# Altium project CPU.3.PrjPcb
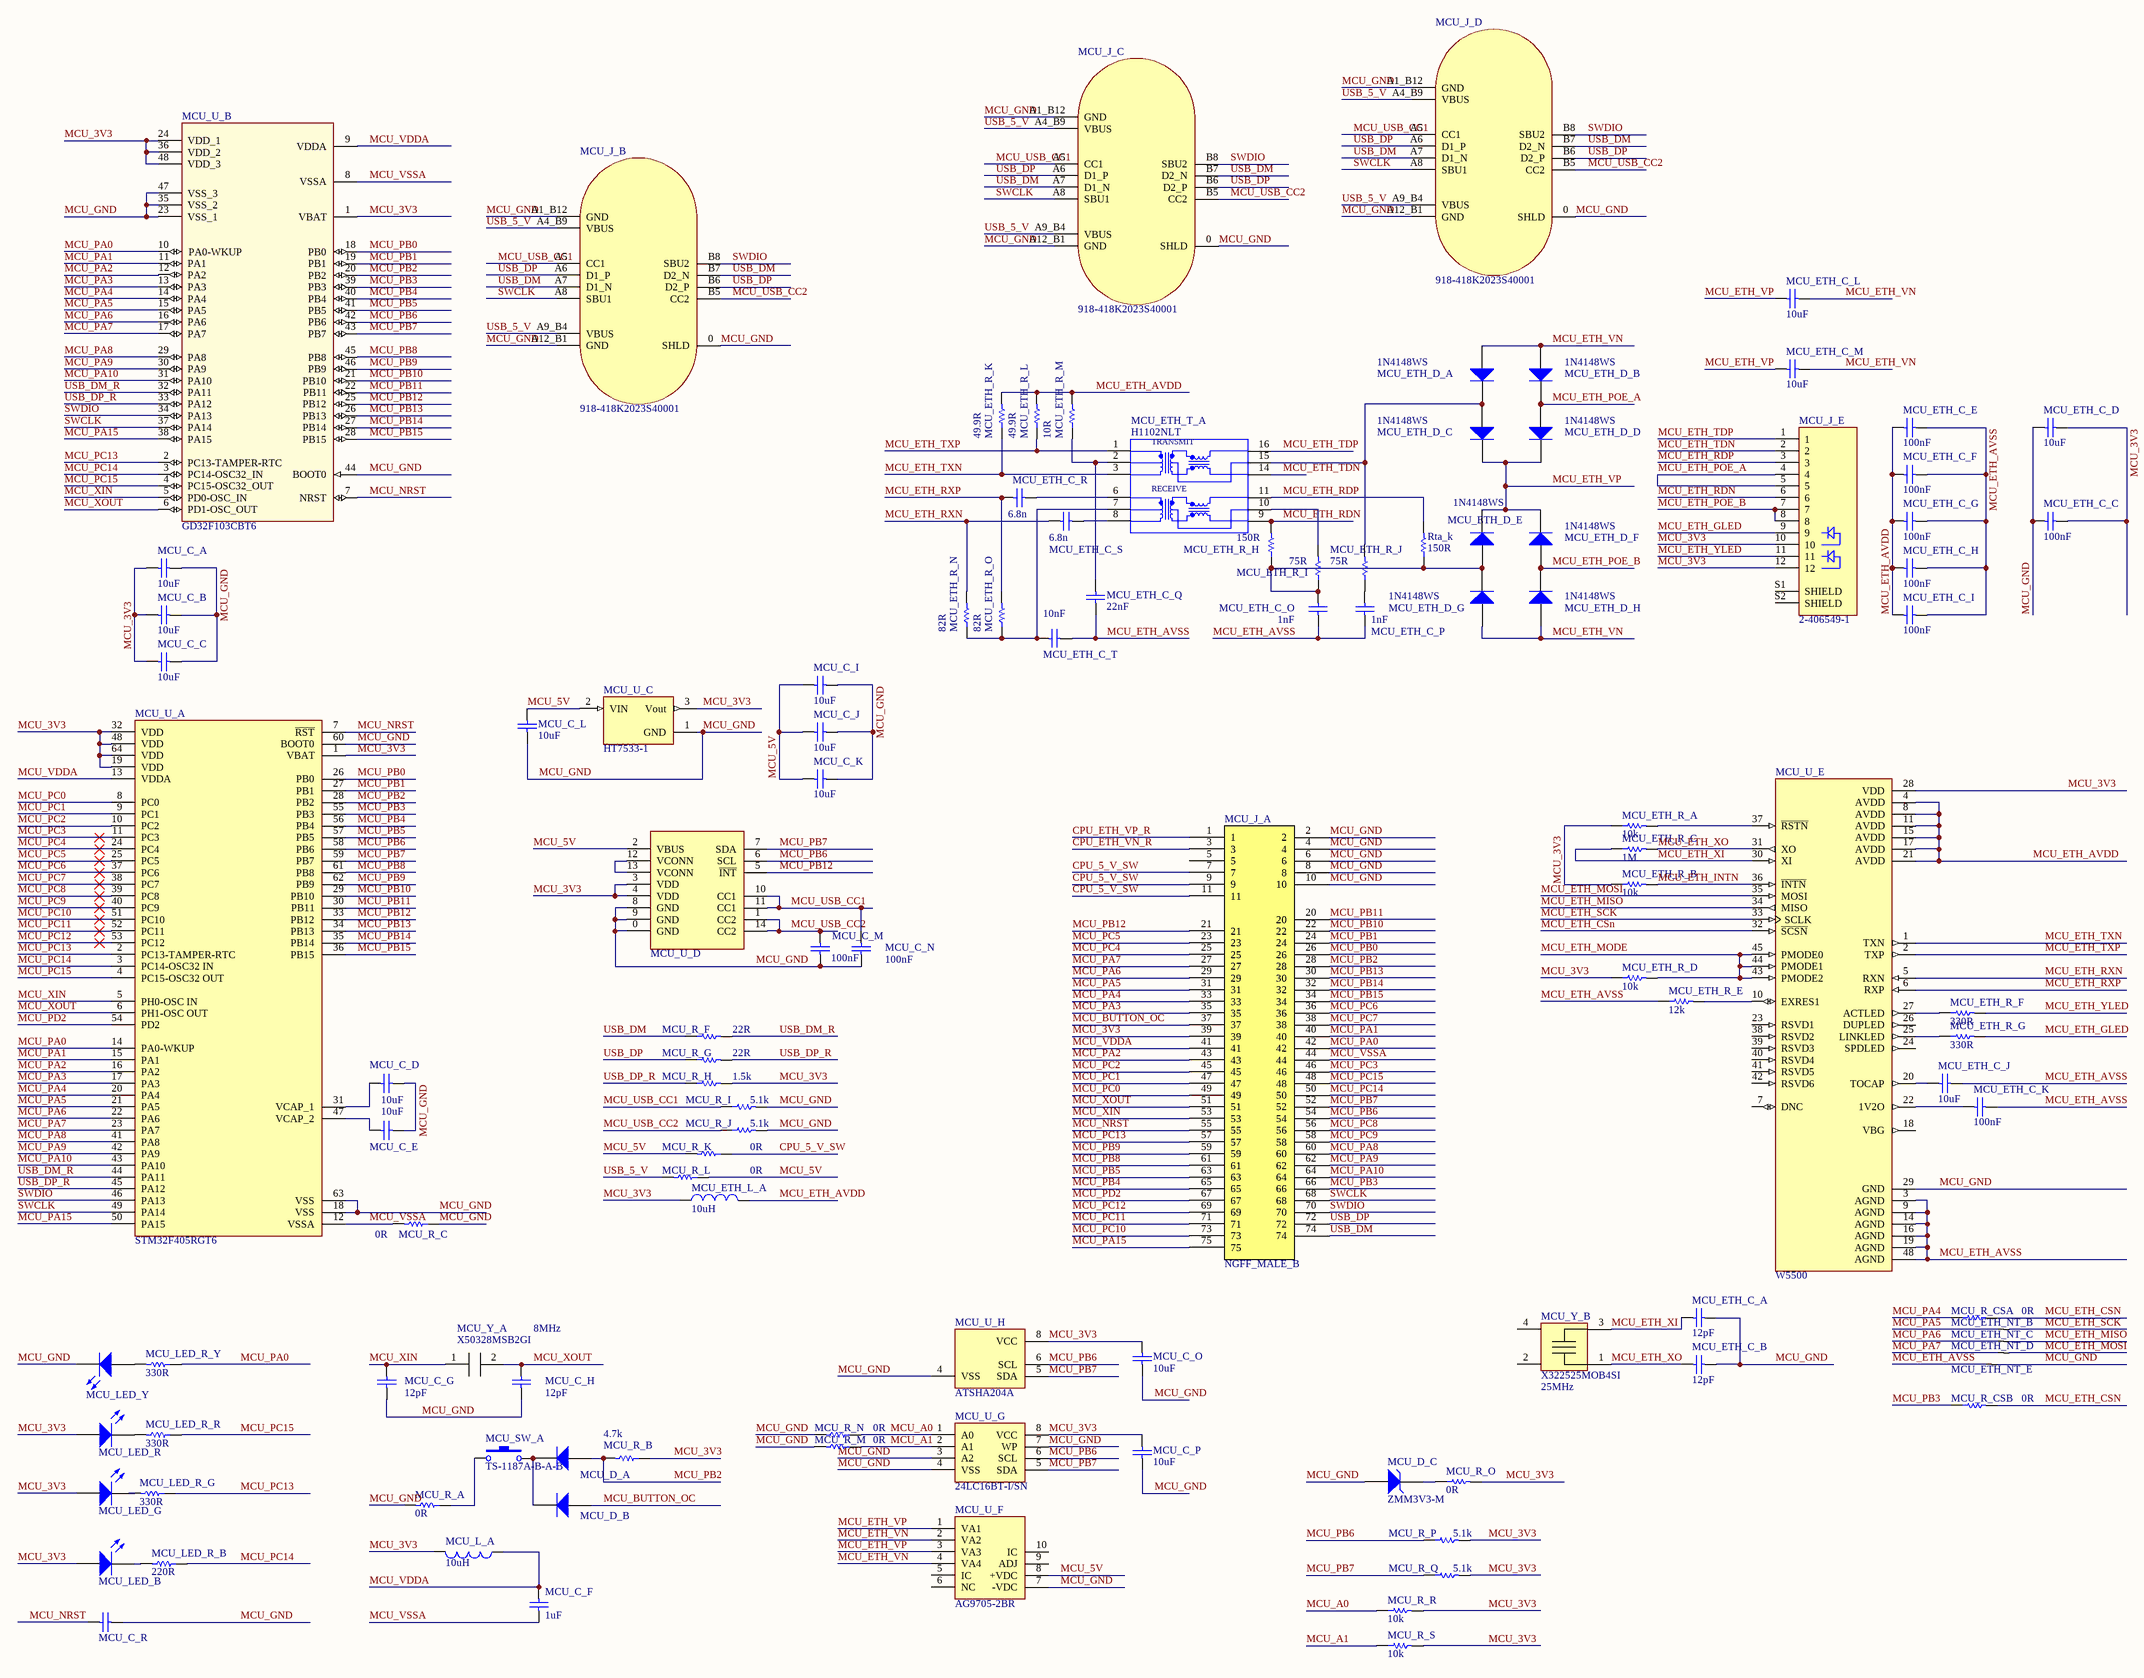
[diagram p0: CPU.3.SchDoc]
1 sheet, 113 parts. Net scope: global (net labels, ports and power ports of the same name join across sheets).
Board file: CPU.3.PcbDoc

## Sheet CPU.3.SchDoc
size C

### Parts
MCU_C_A  value 10uF  [C_0402]  (hidden comment: CL05A106MQ5NUNC)
MCU_C_B  value 10uF  [C_0402]  (hidden comment: CL05A106MQ5NUNC)
MCU_C_C  value 10uF  [C_0402]  (hidden comment: CL05A106MQ5NUNC)
MCU_C_D  value 10uF  [C_0402]  (hidden comment: CL05A106MQ5NUNC)
MCU_C_E  value 10uF  [C_0402]  (hidden comment: CL05A106MQ5NUNC)
MCU_C_F  value 1uF  [C_0402]  (hidden comment: CL05A105KA5NQNC)
MCU_C_G  value 12pF  [C_0402]  (hidden comment: 0402CG120J500NT)
MCU_C_H  value 12pF  [C_0402]  (hidden comment: 0402CG120J500NT)
MCU_C_I  value 10uF  [C_0402]  (hidden comment: CL05A106MQ5NUNC)
MCU_C_J  value 10uF  [C_0402]  (hidden comment: CL05A106MQ5NUNC)
MCU_C_K  value 10uF  [C_0402]  (hidden comment: CL05A106MQ5NUNC)
MCU_C_L  value 10uF  [C_0805]  (hidden comment: CL21A106KAYNNNE)
MCU_C_M  value 100nF  [C_0402]  (hidden comment: CL05B104KO5NNNC)
MCU_C_N  value 100nF  [C_0402]  (hidden comment: CL05B104KO5NNNC)
MCU_C_O  value 10uF  [C_0402]  (hidden comment: CL05A106MQ5NUNC)
MCU_C_P  value 10uF  [C_0402]  (hidden comment: CL05A106MQ5NUNC)
MCU_C_R  0402CG101J500NT  [C_0402]  (value not drawn)
MCU_D_A  1N4148WS  [SOD-323]  (value not drawn)
MCU_D_B  1N4148WS  [SOD-323]  (value not drawn)
MCU_D_C  ZMM3V3-M  [DO-213AA]
MCU_ETH_C_A  value 12pF  [C_0402]  (hidden comment: 0402CG120J500NT)
MCU_ETH_C_B  value 12pF  [C_0402]  (hidden comment: 0402CG120J500NT)
MCU_ETH_C_C  value 100nF  [C_0402]  (hidden comment: CL05B104KO5NNNC)
MCU_ETH_C_D  value 10uF  [C_0402]  (hidden comment: CL05A106MQ5NUNC)
MCU_ETH_C_E  value 100nF  [C_0402]  (hidden comment: CL05B104KO5NNNC)
MCU_ETH_C_F  value 100nF  [C_0402]  (hidden comment: CL05B104KO5NNNC)
MCU_ETH_C_G  value 100nF  [C_0402]  (hidden comment: CL05B104KO5NNNC)
MCU_ETH_C_H  value 100nF  [C_0402]  (hidden comment: CL05B104KO5NNNC)
MCU_ETH_C_I  value 100nF  [C_0402]  (hidden comment: CL05B104KO5NNNC)
MCU_ETH_C_J  value 10uF  [C_0402]  (hidden comment: CL05A106MQ5NUNC)
MCU_ETH_C_K  value 100nF  [C_0402]  (hidden comment: CL05B104KO5NNNC)
MCU_ETH_C_L  value 10uF  [C_0805]  (hidden comment: CL21A106KAYNNNE)
MCU_ETH_C_M  value 10uF  [C_0805]  (hidden comment: CL21A106KAYNNNE)
MCU_ETH_C_O  value 1nF  [C_1206]  (hidden comment: 1206B102K202NT)
MCU_ETH_C_P  value 1nF  [C_1206]  (hidden comment: 1206B102K202NT)
MCU_ETH_C_Q  value 22nF  [C_0402]  (hidden comment: 0402B223K500NT)
MCU_ETH_C_R  value 6.8n  [C_0402]  (hidden comment: 0402B682K500NT)
MCU_ETH_C_S  value 6.8n  [C_0402]  (hidden comment: 0402B682K500NT)
MCU_ETH_C_T  value 10nF  [C_0402]  (hidden comment: CL05B103KB5NNNC)
MCU_ETH_D_A  1N4148WS  [SOD-323]
MCU_ETH_D_B  1N4148WS  [SOD-323]
MCU_ETH_D_C  1N4148WS  [SOD-323]
MCU_ETH_D_D  1N4148WS  [SOD-323]
MCU_ETH_D_E  1N4148WS  [SOD-323]
MCU_ETH_D_F  1N4148WS  [SOD-323]
MCU_ETH_D_G  1N4148WS  [SOD-323]
MCU_ETH_D_H  1N4148WS  [SOD-323]
MCU_ETH_L_A  value 10uH  [L_0603]  (hidden comment: SDFL1608S100KTF)
MCU_ETH_NT_B  0  [NET_TIE]  (value not drawn)
MCU_ETH_NT_C  0  [NET_TIE]  (value not drawn)
MCU_ETH_NT_D  0  [NET_TIE]  (value not drawn)
MCU_ETH_NT_E  0  [NET_TIE]  (value not drawn)
MCU_ETH_R_A  value 10k  [R_0402]  (hidden comment: 0402WGF1002TCE)
MCU_ETH_R_B  value 10k  [R_0402]  (hidden comment: 0402WGF1002TCE)
MCU_ETH_R_C  value 1M  [R_0402]  (hidden comment: 0402WGF1004TCE)
MCU_ETH_R_D  value 10k  [R_0402]  (hidden comment: 0402WGF1002TCE)
MCU_ETH_R_E  value 12k  [R_0402]  (hidden comment: 0402WGF1202TCE)
MCU_ETH_R_F  value 330R  [R_0402]  (hidden comment: 0402WGF3300TCE)
MCU_ETH_R_G  value 330R  [R_0402]  (hidden comment: 0402WGF3300TCE)
MCU_ETH_R_H  value 150R  [R_0402]  (hidden comment: 0402WGF1500TCE)
MCU_ETH_R_I  value 75R  [R_0402]  (hidden comment: 0402WGF750JTCE)
MCU_ETH_R_J  value 75R  [R_0402]  (hidden comment: 0402WGF750JTCE)
MCU_ETH_R_K  value 49.9R  [R_0402]  (hidden comment: 0402WGF499JTCE)
MCU_ETH_R_L  value 49.9R  [R_0402]  (hidden comment: 0402WGF499JTCE)
MCU_ETH_R_M  value 10R  [R_0402]  (hidden comment: 0402WGF100JTCE)
MCU_ETH_R_N  value 82R  [R_0603]  (hidden comment: 0603WAF820JT5E)
MCU_ETH_R_O  value 82R  [R_0603]  (hidden comment: 0603WAF820JT5E)
MCU_ETH_T_A  H1102NLT  [XFMR_H1102NLT]
MCU_J_A  NGFF_MALE_B  [NGFF_MALE_B]
MCU_J_B  918-418K2023S40001  [DX07S016JA1R1500]
MCU_J_C  918-418K2023S40001  [DX07S016JA1R1500]
MCU_J_D  918-418K2023S40001  [DX07S016JA1R1500]
MCU_J_E  2-406549-1  [TE_2-406549-1]
MCU_L_A  value 10uH  [L_0603]  (hidden comment: SDFL1608S100KTF)
MCU_LED_B  19-217/BHC-ZL1M2RY/3T  [D_0603]  (value not drawn)
MCU_LED_G  19-217/GHC-YR1S2/3T  [D_0603]  (value not drawn)
MCU_LED_R  KT-0603R  [D_0603]  (value not drawn)
MCU_LED_R_B  value 220R  [R_0402]  (hidden comment: 0402WGF2200TCE)
MCU_LED_R_G  value 330R  [R_0402]  (hidden comment: 0402WGF3300TCE)
MCU_LED_R_R  value 330R  [R_0402]  (hidden comment: 0402WGF3300TCE)
MCU_LED_R_Y  value 330R  [R_0402]  (hidden comment: 0402WGF3300TCE)
MCU_LED_Y  19-21UYC/S530-A4/TR8  [D_0603]  (value not drawn)
MCU_R_A  value 0R  [R_0402]  (hidden comment: 0402WGF0000TCE)
MCU_R_B  value 4.7k  [R_0402]  (hidden comment: 0402WGF4701TCE)
MCU_R_C  value 0R  [R_0402]  (hidden comment: 0402WGF0000TCE)
MCU_R_CSA  value 0R  [R_0402]  (hidden comment: 0402WGF0000TCE)
MCU_R_CSB  value 0R  [R_0402]  (hidden comment: 0402WGF0000TCE)
MCU_R_F  value 22R  [R_0402]  (hidden comment: 0402WGF220JTCE)
MCU_R_G  value 22R  [R_0402]  (hidden comment: 0402WGF220JTCE)
MCU_R_H  value 1.5k  [R_0402]  (hidden comment: 0402WGF1501TCE)
MCU_R_I  value 5.1k  [R_0402]  (hidden comment: 0402WGF5101TCE)
MCU_R_J  value 5.1k  [R_0402]  (hidden comment: 0402WGF5101TCE)
MCU_R_K  value 0R  [R_0402]  (hidden comment: 0402WGF0000TCE)
MCU_R_L  value 0R  [R_0402]  (hidden comment: 0402WGF0000TCE)
MCU_R_M  value 0R  [R_0402]  (hidden comment: 0402WGF0000TCE)
MCU_R_N  value 0R  [R_0402]  (hidden comment: 0402WGF0000TCE)
MCU_R_O  value 0R  [R_0402]  (hidden comment: 0402WGF0000TCE)
MCU_R_P  value 5.1k  [R_0402]  (hidden comment: 0402WGF5101TCE)
MCU_R_Q  value 5.1k  [R_0402]  (hidden comment: 0402WGF5101TCE)
MCU_R_R  value 10k  [R_0402]  (hidden comment: 0402WGF1002TCE)
MCU_R_S  value 10k  [R_0402]  (hidden comment: 0402WGF1002TCE)
MCU_SW_A  TS-1187A-B-A-B  [TS-1187A-C-C-B]
MCU_U_A  STM32F405RGT6  [QFP-64-P0.5MM]
MCU_U_B  GD32F103CBT6  [QFP-48-P0.5MM]
MCU_U_C  HT7533-1  [SOT-223-3]
MCU_U_D  FUSB302BMPX  [QFN-14-P0.5MM]  (value not drawn)
MCU_U_E  W5500  [QFP-48-P0.5MM]
MCU_U_F  AG9705-2BR  [AG9000]
MCU_U_G  24LC16BT-I/SN  [SOIC-8-P1.27-W3.5]
MCU_U_H  ATSHA204A  [SOIC-8-P1.27-W3.5]
MCU_Y_A  X50328MSB2GI  value 8MHz  [YSX530GA]
MCU_Y_B  X322525MOB4SI  value 25MHz  [X322512MSB4SI]
Rta_k  value 150R  [R_0402]  (hidden comment: 0402WGF1500TCE)

### Nets
CPU_5_V_SW: MCU_J_A.7 MCU_J_A.9 MCU_J_A.11 MCU_R_K.1
CPU_ETH_VN_R: MCU_J_A.3
CPU_ETH_VP_R: MCU_J_A.1
MCU_3V3: MCU_C_A.1 MCU_C_B.1 MCU_C_C.1 MCU_C_O.2 MCU_C_P.2 MCU_ETH_C_C.2 MCU_ETH_C_D.1 MCU_ETH_L_A.1 MCU_ETH_R_A.1 MCU_ETH_R_B.1 MCU_ETH_R_D.1 MCU_J_A.39 MCU_J_E.10 MCU_J_E.12 MCU_L_A.2 MCU_LED_B.2(A) MCU_LED_G.2(A) MCU_LED_R.2(A) MCU_R_B.1 MCU_R_H.2 MCU_R_O.2 MCU_R_P.2 MCU_R_Q.2 MCU_R_R.2 MCU_R_S.2 MCU_U_A.1(VBAT) MCU_U_A.19(VDD) MCU_U_A.32(VDD) MCU_U_A.48(VDD) MCU_U_A.64(VDD) MCU_U_B.1(VBAT) MCU_U_B.24(VDD_1) MCU_U_B.36(VDD_2) MCU_U_B.48(VDD_3) MCU_U_C.3(Vout) MCU_U_D.3(VDD) MCU_U_D.4(VDD) MCU_U_E.28(VDD) MCU_U_G.8(VCC) MCU_U_H.8(VCC)
MCU_5V: MCU_C_I.1 MCU_C_J.1 MCU_C_K.1 MCU_C_L.2 MCU_R_K.2 MCU_R_L.1 MCU_U_C.2(VIN) MCU_U_D.2(VBUS) MCU_U_F.8(+VDC)
MCU_A0: MCU_R_N.1 MCU_R_R.1 MCU_U_G.1(A0)
MCU_A1: MCU_R_M.1 MCU_R_S.1 MCU_U_G.2(A1)
MCU_BUTTON_OC: MCU_D_B.2(A) MCU_J_A.37
MCU_ETH_AVDD: MCU_ETH_C_E.2 MCU_ETH_C_F.2 MCU_ETH_C_G.2 MCU_ETH_C_H.2 MCU_ETH_C_I.2 MCU_ETH_L_A.2 MCU_ETH_R_K.2 MCU_ETH_R_L.2 MCU_ETH_R_M.2 MCU_U_E.4(AVDD) MCU_U_E.8(AVDD) MCU_U_E.11(AVDD) MCU_U_E.15(AVDD) MCU_U_E.17(AVDD) MCU_U_E.21(AVDD)
MCU_ETH_AVSS: MCU_ETH_C_E.1 MCU_ETH_C_F.1 MCU_ETH_C_G.1 MCU_ETH_C_H.1 MCU_ETH_C_I.1 MCU_ETH_C_J.2 MCU_ETH_C_K.1 MCU_ETH_C_O.1 MCU_ETH_C_P.1 MCU_ETH_C_Q.1 MCU_ETH_C_T.2 MCU_ETH_NT_E.1 MCU_ETH_R_E.1 MCU_U_E.3(AGND) MCU_U_E.9(AGND) MCU_U_E.14(AGND) MCU_U_E.16(AGND) MCU_U_E.19(AGND) MCU_U_E.48(AGND)
MCU_ETH_CSn: MCU_R_CSA.2 MCU_R_CSB.2 MCU_U_E.32(~{SCSN})
MCU_ETH_GLED: MCU_ETH_R_G.2 MCU_J_E.9
MCU_ETH_INTN: MCU_ETH_R_B.2 MCU_U_E.36(~{INTN})
MCU_ETH_MISO: MCU_ETH_NT_C.2 MCU_U_E.34(MISO)
MCU_ETH_MODE: MCU_ETH_R_D.2 MCU_U_E.43(PMODE2) MCU_U_E.44(PMODE1) MCU_U_E.45(PMODE0)
MCU_ETH_MOSI: MCU_ETH_NT_D.2 MCU_U_E.35(MOSI)
MCU_ETH_POE_A: MCU_ETH_D_B.1(K) MCU_ETH_D_D.2(A) MCU_J_E.4 MCU_J_E.5
MCU_ETH_POE_B: MCU_ETH_D_F.2(A) MCU_ETH_D_H.1(K) MCU_J_E.7 MCU_J_E.8
MCU_ETH_RDN: MCU_ETH_R_H.2 MCU_ETH_T_A.9 MCU_J_E.6
MCU_ETH_RDP: MCU_ETH_T_A.11 MCU_J_E.3 Rta_k.2
MCU_ETH_RXN: MCU_ETH_C_S.1 MCU_ETH_R_N.2 MCU_U_E.5(RXN)
MCU_ETH_RXP: MCU_ETH_C_R.1 MCU_ETH_R_O.2 MCU_U_E.6(RXP)
MCU_ETH_SCK: MCU_ETH_NT_B.2 MCU_U_E.33(SCLK)
MCU_ETH_TDN: MCU_ETH_T_A.14 MCU_J_E.2
MCU_ETH_TDP: MCU_ETH_T_A.16 MCU_J_E.1
MCU_ETH_TXN: MCU_ETH_R_K.1 MCU_ETH_T_A.3 MCU_U_E.1(TXN)
MCU_ETH_TXP: MCU_ETH_R_L.1 MCU_ETH_T_A.1 MCU_U_E.2(TXP)
MCU_ETH_VN: MCU_ETH_C_L.1 MCU_ETH_C_M.1 MCU_ETH_D_A.2(A) MCU_ETH_D_B.2(A) MCU_ETH_D_G.2(A) MCU_ETH_D_H.2(A) MCU_U_F.2(VA2) MCU_U_F.4(VA4)
MCU_ETH_VP: MCU_ETH_C_L.2 MCU_ETH_C_M.2 MCU_ETH_D_C.1(K) MCU_ETH_D_D.1(K) MCU_ETH_D_E.1(K) MCU_ETH_D_F.1(K) MCU_U_F.1(VA1) MCU_U_F.3(VA3)
MCU_ETH_XI: MCU_ETH_C_A.2 MCU_ETH_R_C.1 MCU_U_E.30(XI) MCU_Y_B.3
MCU_ETH_XO: MCU_ETH_C_B.2 MCU_ETH_R_C.2 MCU_U_E.31(XO) MCU_Y_B.1
MCU_ETH_YLED: MCU_ETH_R_F.2 MCU_J_E.11
MCU_GND: MCU_C_A.2 MCU_C_B.2 MCU_C_C.2 MCU_C_D.2 MCU_C_E.2 MCU_C_G.1 MCU_C_H.1 MCU_C_I.2 MCU_C_J.2 MCU_C_K.2 MCU_C_L.1 MCU_C_M.2 MCU_C_N.2 MCU_C_O.1 MCU_C_P.1 MCU_C_R.1 MCU_D_C.2(A) MCU_ETH_C_A.1 MCU_ETH_C_B.1 MCU_ETH_C_C.1 MCU_ETH_C_D.2 MCU_ETH_NT_E.2 MCU_J_A.2 MCU_J_A.4 MCU_J_A.6 MCU_J_A.8 MCU_J_A.10 MCU_J_B.0(SHLD) MCU_J_B.A1_B12(GND) MCU_J_B.A12_B1(GND) MCU_J_C.0(SHLD) MCU_J_C.A1_B12(GND) MCU_J_C.A12_B1(GND) MCU_J_D.0(SHLD) MCU_J_D.A1_B12(GND) MCU_J_D.A12_B1(GND) MCU_LED_Y.1(K) MCU_R_A.2 MCU_R_C.1 MCU_R_I.2 MCU_R_J.2 MCU_R_M.2 MCU_R_N.2 MCU_U_A.18(VSS) MCU_U_A.60(BOOT0) MCU_U_A.63(VSS) MCU_U_B.23(VSS_1) MCU_U_B.35(VSS_2) MCU_U_B.44(BOOT0) MCU_U_B.47(VSS_3) MCU_U_C.1(GND) MCU_U_D.0(GND) MCU_U_D.8(GND) MCU_U_D.9(GND) MCU_U_E.29(GND) MCU_U_F.7(-VDC) MCU_U_G.3(A2) MCU_U_G.4(VSS) MCU_U_G.7(WP) MCU_U_H.4(VSS)
MCU_NRST: MCU_C_R.2 MCU_J_A.55 MCU_U_A.7(~{RST}) MCU_U_B.7(NRST)
MCU_PA0: MCU_J_A.42 MCU_LED_R_Y.1 MCU_U_A.14(PA0-WKUP) MCU_U_B.10(PA0-WKUP)
MCU_PA1: MCU_J_A.40 MCU_U_A.15(PA1) MCU_U_B.11(PA1)
MCU_PA2: MCU_J_A.43 MCU_U_A.16(PA2) MCU_U_B.12(PA2)
MCU_PA3: MCU_J_A.35 MCU_U_A.17(PA3) MCU_U_B.13(PA3)
MCU_PA4: MCU_J_A.33 MCU_R_CSA.1 MCU_U_A.20(PA4) MCU_U_B.14(PA4)
MCU_PA5: MCU_ETH_NT_B.1 MCU_J_A.31 MCU_U_A.21(PA5) MCU_U_B.15(PA5)
MCU_PA6: MCU_ETH_NT_C.1 MCU_J_A.29 MCU_U_A.22(PA6) MCU_U_B.16(PA6)
MCU_PA7: MCU_ETH_NT_D.1 MCU_J_A.27 MCU_U_A.23(PA7) MCU_U_B.17(PA7)
MCU_PA8: MCU_J_A.60 MCU_U_A.41(PA8) MCU_U_B.29(PA8)
MCU_PA9: MCU_J_A.62 MCU_U_A.42(PA9) MCU_U_B.30(PA9)
MCU_PA10: MCU_J_A.64 MCU_U_A.43(PA10) MCU_U_B.31(PA10)
MCU_PA15: MCU_J_A.75 MCU_U_A.50(PA15) MCU_U_B.38(PA15)
MCU_PB0: MCU_J_A.26 MCU_U_A.26(PB0) MCU_U_B.18(PB0)
MCU_PB1: MCU_J_A.24 MCU_U_A.27(PB1) MCU_U_B.19(PB1)
MCU_PB2: MCU_D_A.2(A) MCU_J_A.28 MCU_R_B.2 MCU_U_A.28(PB2) MCU_U_B.20(PB2)
MCU_PB3: MCU_J_A.66 MCU_R_CSB.1 MCU_U_A.55(PB3) MCU_U_B.39(PB3)
MCU_PB4: MCU_J_A.65 MCU_U_A.56(PB4) MCU_U_B.40(PB4)
MCU_PB5: MCU_J_A.63 MCU_U_A.57(PB5) MCU_U_B.41(PB5)
MCU_PB6: MCU_J_A.54 MCU_R_P.1 MCU_U_A.58(PB6) MCU_U_B.42(PB6) MCU_U_D.6(SCL) MCU_U_G.6(SCL) MCU_U_H.6(SCL)
MCU_PB7: MCU_J_A.52 MCU_R_Q.1 MCU_U_A.59(PB7) MCU_U_B.43(PB7) MCU_U_D.7(SDA) MCU_U_G.5(SDA) MCU_U_H.5(SDA)
MCU_PB8: MCU_J_A.61 MCU_U_A.61(PB8) MCU_U_B.45(PB8)
MCU_PB9: MCU_J_A.59 MCU_U_A.62(PB9) MCU_U_B.46(PB9)
MCU_PB10: MCU_J_A.22 MCU_U_A.29(PB10) MCU_U_B.21(PB10)
MCU_PB11: MCU_J_A.20 MCU_U_A.30(PB11) MCU_U_B.22(PB11)
MCU_PB12: MCU_J_A.21 MCU_U_A.33(PB12) MCU_U_B.25(PB12) MCU_U_D.5(~{INT})
MCU_PB13: MCU_J_A.30 MCU_U_A.34(PB13) MCU_U_B.26(PB13)
MCU_PB14: MCU_J_A.32 MCU_U_A.35(PB14) MCU_U_B.27(PB14)
MCU_PB15: MCU_J_A.34 MCU_U_A.36(PB15) MCU_U_B.28(PB15)
MCU_PC0: MCU_J_A.49 MCU_U_A.8(PC0)
MCU_PC1: MCU_J_A.47 MCU_U_A.9(PC1)
MCU_PC2: MCU_J_A.45 MCU_U_A.10(PC2)
MCU_PC3: MCU_J_A.46 MCU_U_A.11(PC3)
MCU_PC4: MCU_J_A.25 MCU_U_A.24(PC4)
MCU_PC5: MCU_J_A.23 MCU_U_A.25(PC5)
MCU_PC6: MCU_J_A.36 MCU_U_A.37(PC6)
MCU_PC7: MCU_J_A.38 MCU_U_A.38(PC7)
MCU_PC8: MCU_J_A.56 MCU_U_A.39(PC8)
MCU_PC9: MCU_J_A.58 MCU_U_A.40(PC9)
MCU_PC10: MCU_J_A.73 MCU_U_A.51(PC10)
MCU_PC11: MCU_J_A.71 MCU_U_A.52(PC11)
MCU_PC12: MCU_J_A.69 MCU_U_A.53(PC12)
MCU_PC13: MCU_J_A.57 MCU_LED_R_G.1 MCU_U_A.2(PC13-TAMPER-RTC) MCU_U_B.2(PC13-TAMPER-RTC)
MCU_PC14: MCU_J_A.50 MCU_LED_R_B.1 MCU_U_A.3(PC14-OSC32_IN) MCU_U_B.3(PC14-OSC32_IN)
MCU_PC15: MCU_J_A.48 MCU_LED_R_R.1 MCU_U_A.4(PC15-OSC32_OUT) MCU_U_B.4(PC15-OSC32_OUT)
MCU_PD2: MCU_J_A.67 MCU_U_A.54(PD2)
MCU_USB_CC1: MCU_C_N.1 MCU_J_B.A5(CC1) MCU_J_C.A5(CC1) MCU_J_D.A5(CC1) MCU_R_I.1 MCU_U_D.10(CC1) MCU_U_D.11(CC1)
MCU_USB_CC2: MCU_C_M.1 MCU_J_B.B5(CC2) MCU_J_C.B5(CC2) MCU_J_D.B5(CC2) MCU_R_J.1 MCU_U_D.1(CC2) MCU_U_D.14(CC2)
MCU_VDDA: MCU_C_F.2 MCU_J_A.41 MCU_L_A.1 MCU_U_A.13(VDDA) MCU_U_B.9(VDDA)
MCU_VSSA: MCU_C_F.1 MCU_J_A.44 MCU_R_C.2 MCU_U_A.12(VSSA) MCU_U_B.8(VSSA)
MCU_XIN: MCU_C_G.2 MCU_J_A.53 MCU_U_A.5(PH0-OSC_IN) MCU_U_B.5(PD0-OSC_IN) MCU_Y_A.1
MCU_XOUT: MCU_C_H.2 MCU_J_A.51 MCU_U_A.6(PH1-OSC_OUT) MCU_U_B.6(PD1-OSC_OUT) MCU_Y_A.2
SWCLK: MCU_J_A.68 MCU_J_B.A8(SBU1) MCU_J_C.A8(SBU1) MCU_J_D.A8(SBU1) MCU_U_A.49(PA14) MCU_U_B.37(PA14)
SWDIO: MCU_J_A.70 MCU_J_B.B8(SBU2) MCU_J_C.B8(SBU2) MCU_J_D.B8(SBU2) MCU_U_A.46(PA13) MCU_U_B.34(PA13)
USB_5_V: MCU_J_B.A4_B9(VBUS) MCU_J_B.A9_B4(VBUS) MCU_J_C.A4_B9(VBUS) MCU_J_C.A9_B4(VBUS) MCU_J_D.A4_B9(VBUS) MCU_J_D.A9_B4(VBUS) MCU_R_L.2
USB_DM: MCU_J_A.74 MCU_J_B.A7(D1_N) MCU_J_B.B7(D2_N) MCU_J_C.A7(D1_N) MCU_J_C.B7(D2_N) MCU_J_D.A7(D1_N) MCU_J_D.B7(D2_N) MCU_R_F.1
USB_DM_R: MCU_R_F.2 MCU_U_A.44(PA11) MCU_U_B.32(PA11)
USB_DP: MCU_J_A.72 MCU_J_B.A6(D1_P) MCU_J_B.B6(D2_P) MCU_J_C.A6(D1_P) MCU_J_C.B6(D2_P) MCU_J_D.A6(D1_P) MCU_J_D.B6(D2_P) MCU_R_G.1
USB_DP_R: MCU_R_G.2 MCU_R_H.1 MCU_U_A.45(PA12) MCU_U_B.33(PA12)
NetMCU_C_D_1: MCU_C_D.1 MCU_U_A.31(VCAP_1)
NetMCU_C_E_1: MCU_C_E.1 MCU_U_A.47(VCAP_2)
NetMCU_D_A_1: MCU_D_A.1(K) MCU_D_B.1(K) MCU_SW_A.2
NetMCU_D_C_1: MCU_D_C.1(K) MCU_R_O.1
NetMCU_ETH_C_J_1: MCU_ETH_C_J.1 MCU_U_E.20(TOCAP)
NetMCU_ETH_C_K_2: MCU_ETH_C_K.2 MCU_U_E.22(1V2O)
NetMCU_ETH_C_O_2: MCU_ETH_C_O.2 MCU_ETH_D_E.2(A) MCU_ETH_D_G.1(K) MCU_ETH_R_H.1 MCU_ETH_R_I.1 Rta_k.1
NetMCU_ETH_C_P_2: MCU_ETH_C_P.2 MCU_ETH_R_J.1
NetMCU_ETH_C_Q_2: MCU_ETH_C_Q.2 MCU_ETH_R_M.1 MCU_ETH_T_A.2
NetMCU_ETH_C_R_2: MCU_ETH_C_R.2 MCU_ETH_T_A.6
NetMCU_ETH_C_S_2: MCU_ETH_C_S.2 MCU_ETH_T_A.8
NetMCU_ETH_C_T_1: MCU_ETH_C_T.1 MCU_ETH_R_N.1 MCU_ETH_R_O.1 MCU_ETH_T_A.7
NetMCU_ETH_D_A_1: MCU_ETH_D_A.1(K) MCU_ETH_D_C.2(A) MCU_ETH_R_J.2 MCU_ETH_T_A.15
NetMCU_ETH_R_A_2: MCU_ETH_R_A.2 MCU_U_E.37(~{RSTN})
NetMCU_ETH_R_E_2: MCU_ETH_R_E.2 MCU_U_E.10(EXRES1)
NetMCU_ETH_R_F_1: MCU_ETH_R_F.1 MCU_U_E.27(ACTLED)
NetMCU_ETH_R_G_1: MCU_ETH_R_G.1 MCU_U_E.25(LINKLED)
NetMCU_ETH_R_I_2: MCU_ETH_R_I.2 MCU_ETH_T_A.10
NetMCU_LED_B_1: MCU_LED_B.1(K) MCU_LED_R_B.2
NetMCU_LED_G_1: MCU_LED_G.1(K) MCU_LED_R_G.2
NetMCU_LED_R_1: MCU_LED_R.1(K) MCU_LED_R_R.2
NetMCU_LED_R_Y_2: MCU_LED_R_Y.2 MCU_LED_Y.2(A)
NetMCU_R_A_1: MCU_R_A.1 MCU_SW_A.1
NetMCU_U_D_12: MCU_U_D.12(VCONN) MCU_U_D.13(VCONN)

Not connected (* = marked no-connect by the designer): MCU_J_A 5; MCU_J_E S1(SHIELD) S2(SHIELD); MCU_U_E 7(DNC) 18(VBG) 23(RSVD1) 24(SPDLED) 26(DUPLED) 38(RSVD2) 39(RSVD3) 40(RSVD4) 41(RSVD5) 42(RSVD6); MCU_U_F 5(IC) 6(NC) 9(ADJ) 10(IC); MCU_Y_B 2(GND) 4(GND)

### Notes on the sheet
- (in symbol H1102NLT) TRANSMIT; RECEIVE

### Library data of the parts
MCU_C_A MCU_C_B MCU_C_C MCU_C_D MCU_C_E MCU_C_I MCU_C_J MCU_C_K MCU_C_O MCU_C_P MCU_ETH_C_D MCU_ETH_C_J = CL05A106MQ5NUNC: C - CAPACITOR - MLCC - 10uF - 6.3V - 0402; WVDC: 6.3; LCSC Part #: C15525; JLC Availability: Basic
MCU_C_F = CL05A105KA5NQNC: C - CAPACITOR - MLCC - 1uF - 25V - 0402; WVDC: 16; LCSC Part #: C52923; JLC Availability: Basic
MCU_C_G MCU_C_H MCU_ETH_C_A MCU_ETH_C_B = 0402CG120J500NT: C - CAPACITOR - MLCC - 12pF - 50V - 0402; WVDC: 50; LCSC Part #: C1547; JLC Availability: Basic
MCU_C_L MCU_ETH_C_L MCU_ETH_C_M = CL21A106KAYNNNE: C - CAPACITOR - MLCC - 10uF - 25V - 0805; WVDC: 25; LCSC Part #: C15850; Availability: Basic
MCU_C_M MCU_C_N MCU_ETH_C_C MCU_ETH_C_E MCU_ETH_C_F MCU_ETH_C_G MCU_ETH_C_H MCU_ETH_C_I MCU_ETH_C_K = CL05B104KO5NNNC: C - CAPACITOR - MLCC - 100nF - 16V - 0402; WVDC: 16; LCSC Part #: C1525; JLC Availability: Basic
MCU_C_R = 0402CG101J500NT: C - CAPACITOR - MLCC - 100pF - 50V - 0402; LCSC Part #: C1546; JLC Availability: Extended
MCU_D_A MCU_D_B MCU_ETH_D_A MCU_ETH_D_B MCU_ETH_D_C MCU_ETH_D_D MCU_ETH_D_E MCU_ETH_D_F MCU_ETH_D_G MCU_ETH_D_H = 1N4148WS: D - DIODE - FAST TRR - 100V - 150mA - 4ns; LCSC Part #: C2128; JLC Availability: Basic; PIV: 100V; If: 150mA; Trr: 4ns
MCU_D_C = ZMM3V3-M: D - DIODE - ZENER - 3.3V - 500mW; LCSC Part #: C8056; JLC Availability: Basic
MCU_ETH_C_O MCU_ETH_C_P = 1206B102K202NT: C - CAPACITOR - MLCC - 1nF - 2000V - 1206 - X7R; WVDC: 2000; LCSC Part #: C9196; JLC Availability: Basic
MCU_ETH_C_Q = 0402B223K500NT: C - CAPACITOR - MLCC - 22nF - 50V - 0402; WVDC: 50; LCSC Part #: C1532; JLC Availability: Basic
MCU_ETH_C_R MCU_ETH_C_S = 0402B682K500NT: C - CAPACITOR - MLCC - 6.8nF - 50V - 0402; WVDC: 50; LCSC Part #: C1542; JLC Availability: Basic
MCU_ETH_C_T = CL05B103KB5NNNC: C - CAPACITOR - MLCC - 10nF - 50V - 0402; WVDC: 50; LCSC Part #: C15195; JLC Availability: Basic
MCU_ETH_L_A MCU_L_A = SDFL1608S100KTF: L - INDUCTOR - 10uH - 0603; JLC Availability: Basic; LCSC Part #: C1035
MCU_ETH_NT_B MCU_ETH_NT_C MCU_ETH_NT_D MCU_ETH_NT_E = NET_TIE: R - Net Tie
MCU_ETH_R_A MCU_ETH_R_B MCU_ETH_R_D MCU_R_R MCU_R_S = 0402WGF1002TCE: R - RESISTOR - SMD - 10k - 1% - 0402; LCSC Part #: C25744; JLC Availability: Basic
MCU_ETH_R_C = 0402WGF1004TCE: R - RESISTOR - SMD - 1M - 1% - 0402; LCSC Part #: C26083; JLC Availability: Basic
MCU_ETH_R_E = 0402WGF1202TCE: R - RESISTOR - SMD - 12k - 1% - 0402; LCSC Part #: C25752; JLC Availability: Basic
MCU_ETH_R_F MCU_ETH_R_G MCU_LED_R_G MCU_LED_R_R MCU_LED_R_Y = 0402WGF3300TCE: R - RESISTOR - SMD - 330R - 1% - 0402; LCSC Part #: C25104; JLC Availability: Basic
MCU_ETH_R_H Rta_k = 0402WGF1500TCE: R - RESISTOR - SMD - 150R - 1% - 0402; LCSC Part #: C25082; JLC Availability: Basic
MCU_ETH_R_I MCU_ETH_R_J = 0402WGF750JTCE: R - RESISTOR - SMD - 75R - 1% - 0402; LCSC Part #: C25133; JLC Availability: Basic
MCU_ETH_R_K MCU_ETH_R_L = 0402WGF499JTCE: R - RESISTOR - SMD - 49.9R - 1% - 0402; LCSC Part #: C25120; JLC Availability: Basic
MCU_ETH_R_M = 0402WGF100JTCE: R - RESISTOR - SMD - 10R - 1% - 0402; LCSC Part #: C25077; JLC Availability: Basic
MCU_ETH_R_N MCU_ETH_R_O = 0603WAF820JT5E: R - RESISTOR - SMD - 82R - 1% - 0603; LCSC Part #: C23255; JLC Availability: Basic
MCU_ETH_T_A = H1102NLT: T - Transfrormer - Isolation and Data Interface _Encapsulated_ Pulse Transformer 1:1 Transmitter, 1:1 Receiver Surface Mount; MF: Pulse Electronics; Package: SOIC-16 Pulse; Value: *; LCSC Part #: C18584; MP: H1102NL; SnapEDA_Link: https://www.snapeda.com/parts/H1102NL/Pulse%20Electronics%20Network/view-part/78695/?ref=snap; Availability: Extended
MCU_J_A = NGFF_MALE_B: NGFF Male Finger, B Key; Manufacturer: Kyocera; Manufacturer P/N: 245863050024829
MCU_J_B MCU_J_C MCU_J_D = 918-418K2023S40001: J - JACK - USB - Type C - Recepticle - SMT - 90°; JLC Availability: LCSC; LCSC Part #: C167321
MCU_J_E = 2-406549-1: J - JACK - ETHERNET - Right - THT; LCSC Part #: C125068; JLC Availability: Extended
MCU_LED_B = 19-217/BHC-ZL1M2RY/3T: D - LED - 0603 - Blue; LCSC Part #: C72041; JLC Availability: Basic
MCU_LED_G = 19-217/GHC-YR1S2/3T: D - LED - 0603 - Green; LCSC Part #: C72043; JLC Availability: Basic
MCU_LED_R = KT-0603R: D - LED - 0603 - Red; LCSC Part #: C2286; JLC Availability: Basic
MCU_LED_R_B = 0402WGF2200TCE: R - RESISTOR - SMD - 220R - 1% - 0402; LCSC Part #: C25091; JLC Availability: Basic
MCU_LED_Y = 19-21UYC/S530-A4/TR8: D - LED - 0603 - Yellow (Sodium); LCSC Part #: C409441; JLC Availability: Extended
MCU_R_A MCU_R_C MCU_R_CSA MCU_R_CSB MCU_R_K MCU_R_L MCU_R_M MCU_R_N MCU_R_O = 0402WGF0000TCE: R - RESISTOR - SMD - 0R - 1% - 0402; LCSC Part #: C17168; JLC Availability: Basic
MCU_R_B = 0402WGF4701TCE: R - RESISTOR - SMD - 4.7k - 1% - 0402; LCSC Part #: C25900; JLC Availability: Basic
MCU_R_F MCU_R_G = 0402WGF220JTCE: R - RESISTOR - SMD - 22R - 1% - 0402; LCSC Part #: C25092; JLC Availability: Basic
MCU_R_H = 0402WGF1501TCE: R - RESISTOR - SMD - 1.5k - 1% - 0402; LCSC Part #: C25867; JLC Availability: Basic
MCU_R_I MCU_R_J MCU_R_P MCU_R_Q = 0402WGF5101TCE: R - RESISTOR - SMD - 5.1k - 1% - 0402; LCSC Part #: C25905; JLC Availability: Basic
MCU_SW_A = TS-1187A-B-A-B: SW - SWITCH - SPST - NO - Top Actuated Surface Mount; LCSC Part #: C318884; JLC Availability: Basic
MCU_U_A = STM32F405RGT6: U - IC - MCU 32BIT 1MB FLASH 64LQFP; ComponentLink2Description: Datasheet; ComponentLink1URL: https://upverter.com/upn/revision/179c87d5c3d4f257/; ComponentLink1Description: Upverter; ComponentLink2URL: http://www.st.com/content/ccc/resource/technical/document/datasheet/33/d4/6f/1d/df/0b/4c/6d/CD00161566.pdf/files/CD00161566.pdf/jcr:content/translations/en.CD00161566.pdf; LCSC Part #: C15742; JLC Availability: Extended
MCU_U_B = GD32F103CBT6: U - IC - MCU, 128 KB Flash, 20 KB Internal RAM, 37 I/Os, 48-pin LQFP, -40 to 85 degC; FLASH Size (Prog) (kB): 128; I/Os (High Current): 37; Internal RAM Size (kB): 20; Operating Frequency(F) (Processor speed) (MHz): 72; ComponentLink1Description: Manufacturer URL; ComponentLink1URL: http://www.st.com/web/en/home.html; ComponentLink2Description: Datasheet; ComponentLink2URL: http://www.st.com/st-web-ui/static/active/en/resource/technical/document/datasheet/CD00161566.pdf; ComponentLink3Description: Package Specification; ComponentLink3URL: http://www.st.com/st-web-ui/static/active/en/resource/technical/document/datasheet/DM00058181.pdf; LCSC Part #: C77979; JLC Availability: Extended
MCU_U_C = HT7533-1: U - IC - 3V3 Power Regulator; VOut: 3.3; LCSC Part #: C14289; JLC Availability: Basic
MCU_U_D = FUSB302BMPX: U - IC - USB PD PHY; JLC Availability: Extended; LCSC Part #: C442699
MCU_U_E = W5500: U - IC - Ethernet Controller 10/100 Base-T/TX PHY SPI Interface 48-LQFP (7x7); MF: WIZnet; Value: *; Package: None; LCSC Part #: C32843; Price: None; MP: W5500; Availability: Extended; SnapEDA_Link: https://www.snapeda.com/parts/W5500/WIZnet/view-part/?ref=snap; Purchase-URL: https://pricing.snapeda.com/search/part/W5500/?ref=eda
MCU_U_F = AG9705-2BR: U - IC - POE 5V 9W; VOut: 5; LCSC Part #: -; JLC Availability: None
MCU_U_G = 24LC16BT-I/SN: U - IC - EEPROM 16k; LCSC Part #: C5456; JLC Availability: Extended; Storage: 16K
MCU_U_H = ATSHA204A-SSHDA-B: U - IC - Crypto Authentication IC; LCSC Part #: C53108; JLC Availability: Extended; ?: ?
MCU_Y_A = X50328MSB2GI: Y - RESONATOR - 8MHZ ±10PPM - SMD-5032; Availability: Basic; LCSC Part #: C115962
MCU_Y_B = X322525MOB4SI: Y - RESONATOR - 25MHZ ±10PPM; LCSC Part #: C9006; JLC Availability: Basic

## Assembly variants
F4: not fitted MCU_J_C MCU_J_D MCU_U_B MCU_U_D
F1: not fitted MCU_J_C MCU_J_D MCU_U_A MCU_U_D
F4_USB_ONLY: not fitted MCU_ETH_C_A MCU_ETH_C_B MCU_ETH_C_C MCU_ETH_C_D MCU_ETH_C_E MCU_ETH_C_F MCU_ETH_C_G MCU_ETH_C_H MCU_ETH_C_I MCU_ETH_C_J MCU_ETH_C_K MCU_ETH_C_L MCU_ETH_C_M MCU_ETH_C_O MCU_ETH_C_P MCU_ETH_C_Q MCU_ETH_C_R MCU_ETH_C_S MCU_ETH_C_T MCU_ETH_D_A MCU_ETH_D_B MCU_ETH_D_C MCU_ETH_D_D MCU_ETH_D_E MCU_ETH_D_F MCU_ETH_D_G MCU_ETH_D_H MCU_ETH_L_A MCU_ETH_NT_A MCU_ETH_NT_B MCU_ETH_NT_C MCU_ETH_NT_D MCU_ETH_NT_E MCU_ETH_R_A MCU_ETH_R_B MCU_ETH_R_C MCU_ETH_R_D MCU_ETH_R_E MCU_ETH_R_F MCU_ETH_R_G MCU_ETH_R_H MCU_ETH_R_I MCU_ETH_R_J MCU_ETH_R_K MCU_ETH_R_L MCU_ETH_R_M MCU_ETH_R_N MCU_ETH_R_O MCU_ETH_T_A MCU_J_B MCU_J_C MCU_J_E MCU_U_B MCU_U_D MCU_U_E MCU_U_F MCU_Y_B